# EAGLE design JeeLabs-jeenode-USB (EAGLE 5.07)
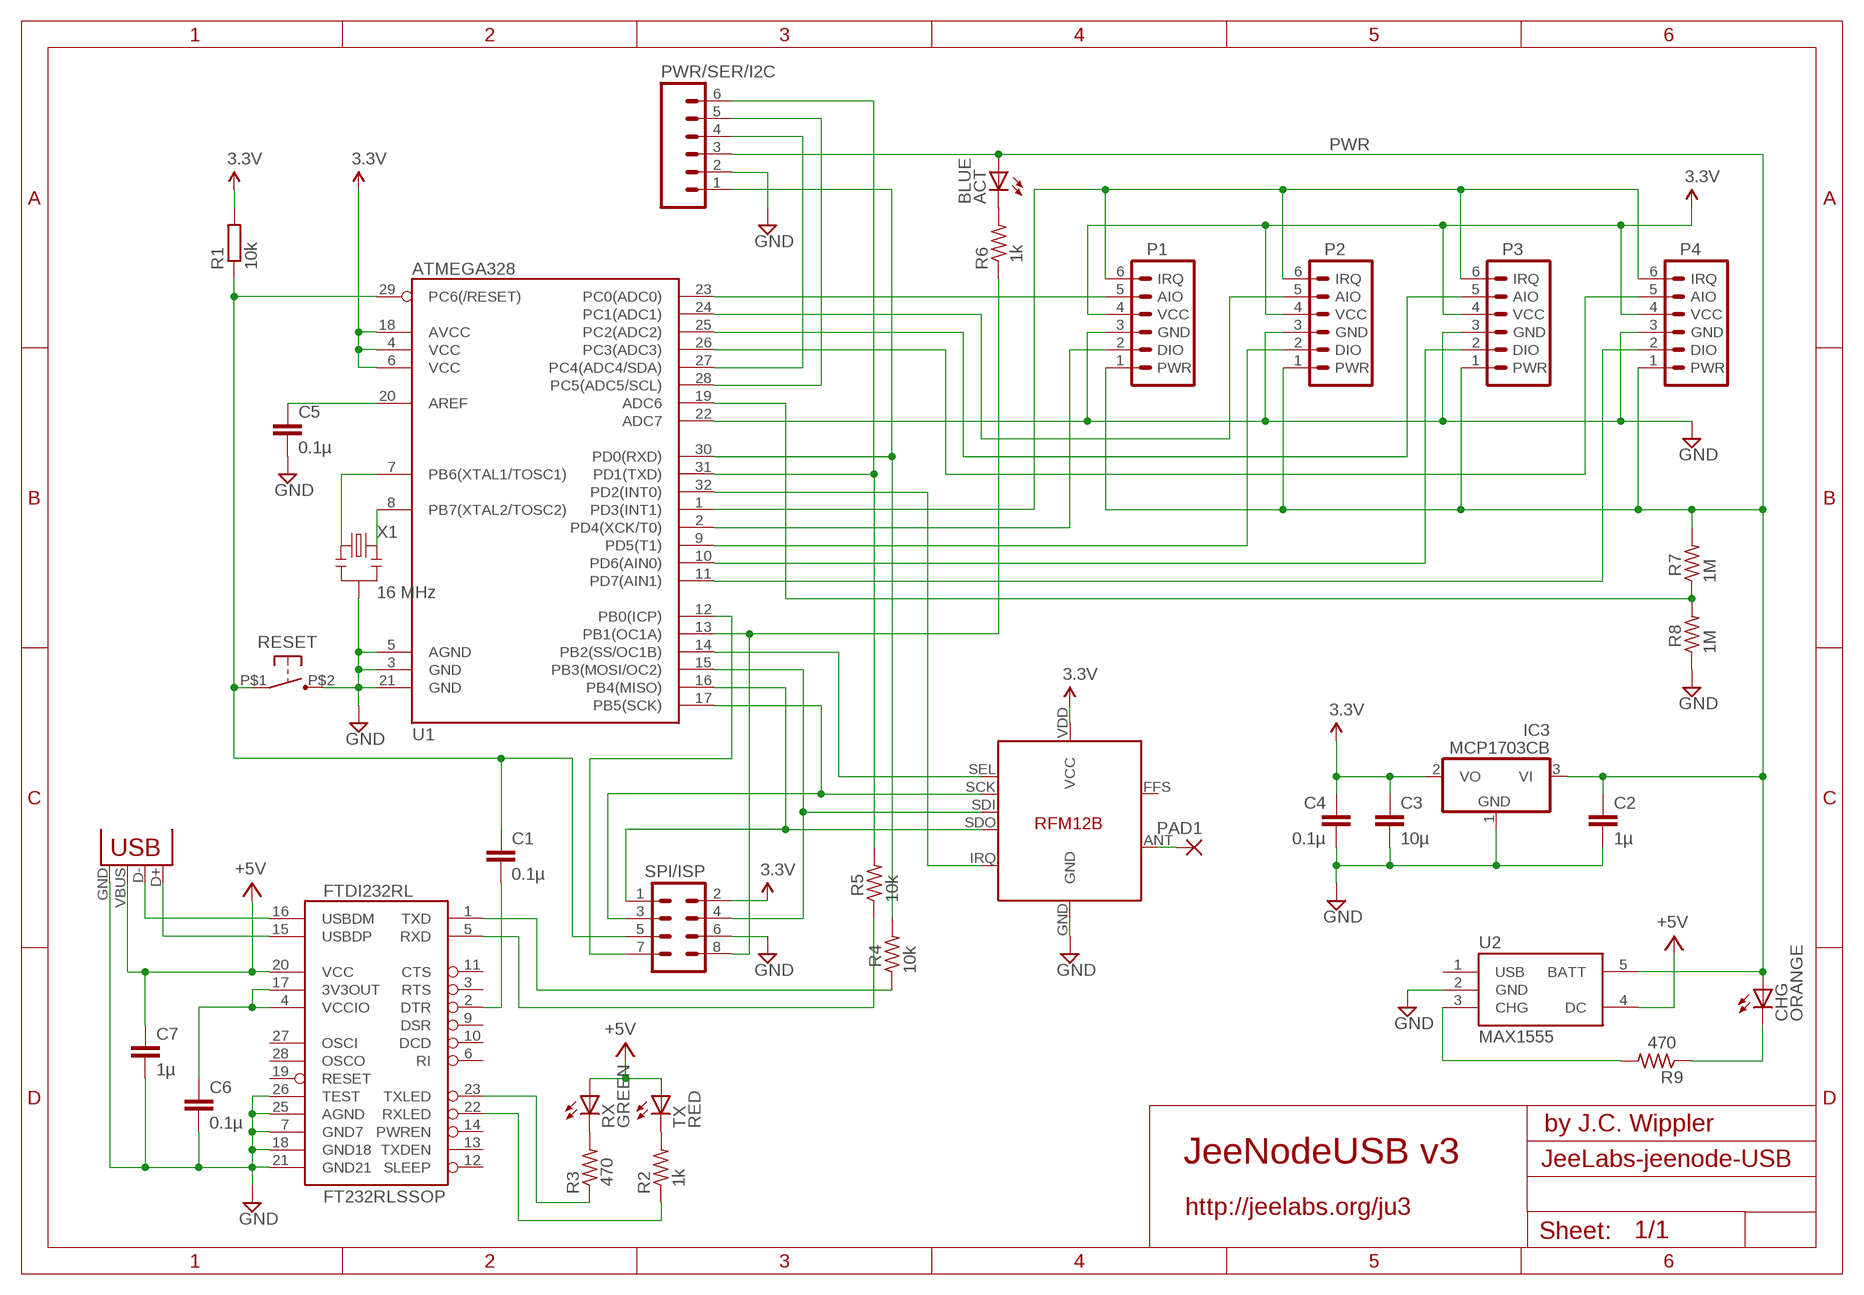
[diagram p0: schematic, sheet 1]

## Parts
ACT  BLUE  LED0603  [LED-0603]
C1  0.1µ  C-EUC0603  [C0603]
C2  1µ  C-EUC0603  [C0603]
C3  10µ  CAP0603-CAP  [0603-CAP]
C4  0.1µ  C-EUC0603  [C0603]
C5  0.1µ  C-EUC0603  [C0603]
C6  0.1µ  C-EUC0603  [C0603]
C7  1µ  C-EUC0603  [C0603]
CHG  ORANGE  LED0603  [LED-0603]
FTDI232RL  FT232RLSSOP  [SSOP28DB]
IC3  MCP1703CB  [SOT23]
P1  JEEPORT  JEEPORT-FEMALE  [1X06_FEMALE_LOCK.010]
P2  JEEPORT  JEEPORT-FEMALE  [1X06_FEMALE_LOCK.010]
P3  JEEPORT  JEEPORT-FEMALE  [1X06_FEMALE_LOCK.010]
P4  JEEPORT  JEEPORT-FEMALE  [1X06_FEMALE_LOCK.010]
PAD1  1,6/0,8  [1,6/0,8]
PWR/SER/I2C  PSI  M06SIP  [1X06]
R1  10k  R-EU_R0603  [R0603]
R2  1k  R-US_R0603  [R0603]
R3  470  R-US_R0603  [R0603]
R4  10k  R-US_R0603  [R0603]
R5  10k  R-US_R0603  [R0603]
R6  1k  R-US_R0603  [R0603]
R7  1M  R-US_R0603  [R0603]
R8  1M  R-US_R0603  [R0603]
R9  470  R-US_R0603  [R0603]
RESET  OMRON_B3U-1000_TACT_SW  [BC3-1000]
RX  GREEN  LED0603  [LED-0603]
SV7  SPI/ISP  MA04-2  [MA04-2]
TX  RED  LED0603  [LED-0603]
U1  ATMEGA328  ATMEGA168  [TQFP32-08]
U2  MAX1555  [SOT23-5]
U$1  RFM12B  [RFM12B]
USB  USBSMD  [USB-MINIB]
X1  16 MHz  RESONATORSMD  [RESONATOR-SMD]

## Nets
3.3V [power]: C3.1 C4.1 IC3.2(VO) P1.4(VCC) P2.4(VCC) P3.4(VCC) P4.4(VCC) R1.2 SV7.2 U1.4(VCC) U1.6(VCC) U1.18(AVCC) U$1.VDD(VCC)
+5V [power]: C7.1 FTDI232RL.20(VCC) RX.A TX.A U2.4(DC) USB.VBUS
A0: P1.5(AIO) U1.23(PC0(ADC0))
A1: P2.5(AIO) U1.24(PC1(ADC1))
A2: P3.5(AIO) U1.25(PC2(ADC2))
A3: P4.5(AIO) U1.26(PC3(ADC3))
GND [power]: C2.2 C3.2 C4.2 C5.2 C6.2 C7.2 FTDI232RL.7(GND7) FTDI232RL.18(GND18) FTDI232RL.21(GND21) FTDI232RL.25(AGND) FTDI232RL.26(TEST) IC3.1(GND) P1.3(GND) P2.3(GND) P3.3(GND) P4.3(GND) PWR/SER/I2C.2 R8.1 RESET.P$2 SV7.6 U1.3(GND) U1.5(AGND) U1.21(GND) U1.22(ADC7) U2.2(GND) U$1.GND USB.GND X1.2
INT1: P1.6(IRQ) P2.6(IRQ) P3.6(IRQ) P4.6(IRQ) U1.1(PD3(INT1))
N$1: U1.7(PB6(XTAL1/TOSC1)) X1.1
N$2: SV7.1 U1.16(PB4(MISO)) U$1.SDO
N$3: SV7.4 U1.15(PB3(MOSI/OC2)) U$1.SDI
N$4: U1.14(PB2(SS/OC1B)) U$1.SEL
N$5: SV7.3 U1.17(PB5(SCK)) U$1.SCK
N$6: R6.1 SV7.8 U1.13(PB1(OC1A))
N$7: U1.32(PD2(INT0)) U$1.IRQ
N$8: P1.2(DIO) U1.2(PD4(XCK/T0))
N$9: P2.2(DIO) U1.9(PD5(T1))
N$10: P3.2(DIO) U1.10(PD6(AIN0))
N$11: P4.2(DIO) U1.11(PD7(AIN1))
N$12: C5.1 U1.20(AREF)
N$13: C1.2 FTDI232RL.2(DTR)
N$14: ACT.C R6.2
N$15: FTDI232RL.16(USBDM) USB.D-
N$16: FTDI232RL.15(USBDP) USB.D+
N$17: FTDI232RL.1(TXD) R4.1
N$18: PAD1.1(P) U$1.ANT
N$19: R7.1 R8.2 U1.19(ADC6)
N$20 [power]: C6.1 FTDI232RL.4(VCCIO) FTDI232RL.17(3V3OUT)
N$21: U1.8(PB7(XTAL2/TOSC2)) X1.3
N$22: SV7.7 U1.12(PB0(ICP))
N$23: CHG.C R9.1
N$24: PWR/SER/I2C.5 U1.28(PC5(ADC5/SCL))
N$25: PWR/SER/I2C.4 U1.27(PC4(ADC4/SDA))
N$26: R9.2 U2.3(CHG)
N$29: R2.2 TX.C
N$30: R3.2 RX.C
N$32: FTDI232RL.23(TXLED) R3.1
N$33: FTDI232RL.22(RXLED) R2.1
PWR [power]: ACT.A C2.1 CHG.A IC3.3(VI) P1.1(PWR) P2.1(PWR) P3.1(PWR) P4.1(PWR) PWR/SER/I2C.3 R7.2 U2.5(BATT)
RST: C1.1 R1.1 RESET.P$1 SV7.5 U1.29(PC6(/RESET))
RXD: PWR/SER/I2C.1 R4.2 U1.30(PD0(RXD))
TXD: PWR/SER/I2C.6 R5.2 U1.31(PD1(TXD))
TXD1: FTDI232RL.5(RXD) R5.1
Unconnected: FTDI232RL.3(RTS) FTDI232RL.6(RI) FTDI232RL.9(DSR) FTDI232RL.10(DCD) FTDI232RL.11(CTS) FTDI232RL.12(SLEEP) FTDI232RL.13(TXDEN) FTDI232RL.14(PWREN) FTDI232RL.19(RESET) FTDI232RL.27(OSCI) FTDI232RL.28(OSCO) U2.1(USB) U$1.FFS

## Notes on the sheet
- by J.C. Wippler
- JeeNodeUSB v3
- http://jeelabs.org/ju3

## Library data of the parts
ACT CHG RX TX = SparkFun:LED: LEDs Standard schematic elements and footprints for 5mm, 3mm, 1206, and 0603 sized LEDs. 5mm - Spark Fun Electronics SKU : COM-00529 (and others)
C1 C2 C4-C7 = resistor:C-EU: CAPACITOR, European symbol
C3 = SparkFun:CAP: Capacitor Standard 0603 ceramic capacitor, and 0.1" leaded capacitor.
FTDI232RL = SparkFun:FT232RL: USB UART FT232RL 4th Generation USB UART (USB <-> Serial) Controller. Spark Fun Electronics SKU : COM-00650
IC3 = linear:MCP1703: 250 mA, 16V, Low Quiescent Current LDO Regulator Source: http://ww1.microchip.com/downloads/en/DeviceDoc/22049b.pdf
P1-P4 = JeeLabs:JEEPORT: PIN HEADER
PAD1 = wirepad:1,6/0,8: THROUGH-HOLE PAD
PWR/SER/I2C = SparkFun:M06: Header 6 Standard 6-pin 0.1" header. Use with straight break away headers (SKU : PRT-00116), right angle break away headers (PRT-00553), swiss pins (PRT-00743), machine pins (PRT-00117), and female headers (PRT-00115). Molex polarized connector foot print use with SKU : PRT-08094 with associated crimp pins and housings. NOTES ON THE VARIANTS LOCK and LOCK_LONGPADS... This footprint was designed to help hold the alignment of a through-hole component (i.e. 6-pin header) while soldering it into place. You may notice that each hole has been shifted either up or down by 0.005 of an inch from it's more standard position (which is a perfectly straight line). This slight alteration caused the pins (the squares in the middle) to touch the edges of the holes. Because they are alternating, it causes a "brace" to hold the component in place. 0.005 has proven to be the perfect amount of "off-center" position when using our standard breakaway headers. Although looks a little odd when you look at the bare footprint, once you have a header in there, the alteration is very hard to notice. Also, if you push a header all the way into place, it is covered up entirely on the bottom side. This idea of altering the position of holes to aid alignment will be further integrated into the Sparkfun Library for other footprints. It can help hold any component with 3 or more connection pins.
R1 = resistor:R-EU_: RESISTOR, European symbol
R2-R9 = rcl:R-US_: RESISTOR, American symbol
RESET = ModernDevice:OMRON_B3U-1000_TACT_SW
SV7 = JeeLabs:MA04-2: PIN HEADER
U1 = SparkFun:ATMEGA168
U2 = SparkFun:MAX1555: MAX1555 Lithium Charger IC SOT-23 Lithium Polymer charging IC. Schematic element and footprint proven. Spark Fun Electronics SKU : COM-00674
U$1 = JeeLabs:RFM12B
USB = SparkFun:USB: USB Connectors USB-B-PTH is fully proven SKU : PRT-00139 USB-miniB is fully proven SKU : PRT-00587 USB-A-PCB is untested. USB-A-H is throughly reviewed, but untested. Spark Fun Electronics SKU : PRT-00437 USB-B-SMT is throughly reviewed, but untested. Needs silkscreen touching up. USB-A-S has not been used/tested USB-MB-H has not been used/tested
X1 = SparkFun:RESONATOR: Resonator Small SMD resonator. This is the itty bitty 10/20MHz resonators with built in caps. CSTCE10M0G55 and CSTCE20M0V53. Footprint has been reviewed closely but hasn't been tested yet.

## Net classes
0 default: width 0.2 mm
1 power: width 0.305 mm

## Board
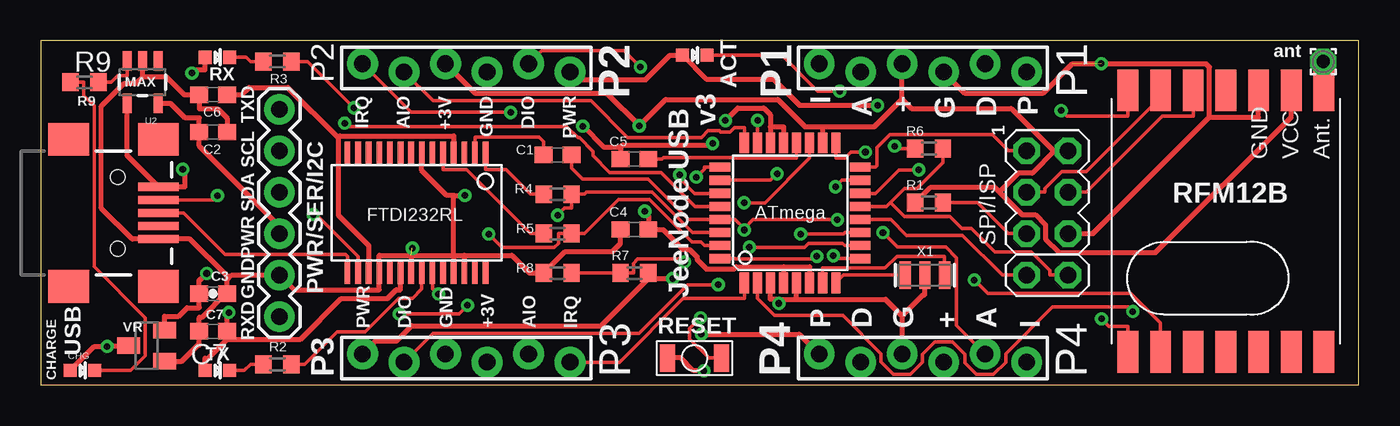
[diagram p1: board, top side]
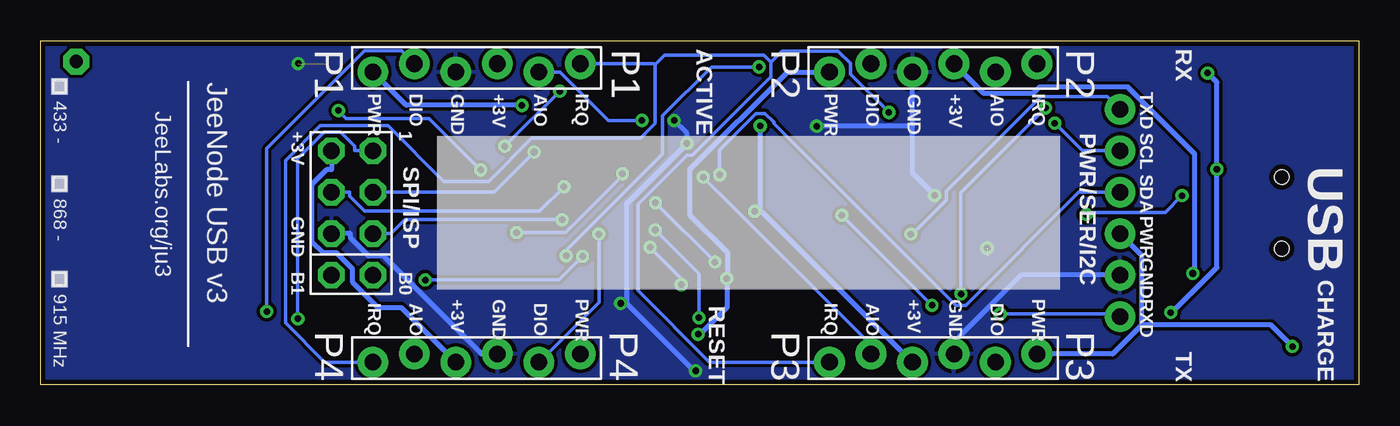
[diagram p2: board, bottom side, seen from below]

Size 80.64 x 21.08 mm. Coordinates in mm from the lower left corner, seen from the top.
Outline: 0,0 80.64,0 80.64,21.08 0,21.08 0,0
Copper layers (1*16): Top 0.035mm / dielectric 1.5mm / Bottom 0.035mm
Design rules "10mils *": minimum track width 0.2mm, minimum drill 0.4mm, track to track 8mil, track to pad 8mil, pad to pad 8mil, via to via 8mil, smd to smd 8mil, copper to edge 12mil, drill to drill 0.4mm, minimum pad ring 0.3mm, minimum via ring 8mil, stop-mask expansion 4mil, vias tented up to drill 20mil, thermal gap 10mil
tRestrict: area 0,0 to 80.6,0.3

### Footprints (pad centres in the part's own frame; a part is rotated, then mirrored left to right if it is on the bottom)
LED-0603 = smd 0.8 x 0.8: A 0,-0.75; C 0,0.75
C0603 = smd 1.1 x 1: 1 -0.85,0; 2 0.85,0
0603-CAP = smd 1.1 x 1: 1 -0.85,0; 2 0.85,0
SSOP28DB = smd 0.348 x 1.397: 1 -4.225,-3.656; 2 -3.575,-3.656; 3 -2.925,-3.656; 4 -2.275,-3.656; 5 -1.625,-3.656; 6 -0.975,-3.656; 7 -0.325,-3.656; 8 0.325,-3.656; 9 0.975,-3.656; 10 1.625,-3.656; 11 2.275,-3.656; 12 2.925,-3.656; 13 3.575,-3.656; 14 4.225,-3.656; 15 4.225,3.656; 16 3.575,3.656; 17 2.925,3.656; 18 2.275,3.656; 19 1.625,3.656; 20 0.975,3.656; 21 0.325,3.656; 22 -0.325,3.656; 23 -0.975,3.656; 24 -1.625,3.656; 25 -2.275,3.656; 26 -2.925,3.656; 27 -3.575,3.656; 28 -4.225,3.656
SOT23 = smd 1 x 1.4: 1 -0.95,-1.1; 2 0.95,-1.1; 3 0,1.1
1X06_FEMALE_LOCK.010 = drill 1.016 pad 1.88 round: 1 0,0.254; 2 2.54,-0.254; 3 5.08,0.254; 4 7.62,-0.254; 5 10.16,0.254; 6 12.7,-0.254
1,6/0,8 = drill 0.813 pad 1.6 octagon: 1 0,0
1X06 = drill 1.016 pad 1.88 round: 1 0,0; 2 2.54,0; 3 5.08,0; 4 7.62,0; 5 10.16,0; 6 12.7,0
R0603 = smd 1 x 1.1: 1 -0.85,0; 2 0.85,0
BC3-1000 = smd 0.9 x 1.7: P$1 1.65,0; P$2 -1.65,0
MA04-2 = drill 1.016 octagon: 1 -3.81,-1.27; 2 -3.81,1.27; 3 -1.27,-1.27; 4 -1.27,1.27; 5 1.27,-1.27; 6 1.27,1.27; 7 3.81,-1.27; 8 3.81,1.27
TQFP32-08 = smd 1.27 x 0.559: 1 -4.293,2.8; 2 -4.293,2; 3 -4.293,1.2; 4 -4.293,0.4; 5 -4.293,-0.4; 6 -4.293,-1.2; 7 -4.293,-2; 8 -4.293,-2.8; 17 4.293,-2.8; 18 4.293,-2; 19 4.293,-1.2; 20 4.293,-0.4; 21 4.293,0.4; 22 4.293,1.2; 23 4.293,2; 24 4.293,2.8 | smd 0.559 x 1.27: 9 -2.8,-4.293; 10 -2,-4.293; 11 -1.2,-4.293; 12 -0.4,-4.293; 13 0.4,-4.293; 14 1.2,-4.293; 15 2,-4.293; 16 2.8,-4.293; 25 2.8,4.293; 26 2,4.293; 27 1.2,4.293; 28 0.4,4.293; 29 -0.4,4.293; 30 -1.2,4.293; 31 -2,4.293; 32 -2.8,4.293
SOT23-5 = smd 0.55 x 1.2: 1 -0.95,-1.3; 2 0,-1.3; 3 0.95,-1.3; 4 0.95,1.3; 5 -0.95,1.3
RFM12B = smd 2.54 x 1.27: ANT 8,-6; FFS -8,2; GND 8,-2; IRQ -8,4; P$8 -8,0; P$9 -8,-2; P$10 -8,-4; P$12 -8,-6; P$16 8,0; SCK 8,4; SDI 8,2; SDO -8,6; SEL 8,6; VDD 8,-4
USB-MINIB = smd 2.5 x 0.5: D+ 2.5,0; D- 2.5,0.8; GND 2.5,-1.6; ID 2.5,-0.8; VBUS 2.5,1.6 | smd 2.5 x 2: GND@1 -3,-4.5; GND@2 -3,4.5; GND@3 2.5,4.5; GND@4 2.5,-4.5 | hole 0.9: 0,2.2; 0,-2.2
RESONATOR-SMD = smd 0.7 x 1.7: 1 -1.2,0; 2 0,0; 3 1.2,0

### Placement (x,y rotation side)
ACT  40.01,20.19 270 top
C1  31.62,14.1 180 top
C2  10.54,15.49 0 top
C3  10.54,5.59 0 top
C4  36.32,9.53 180 top
C5  36.32,13.84 180 top
C6  10.54,17.78 180 top
C7  10.54,3.3 180 top
CHG  2.54,0.89 270 top
FTDI232RL  22.99,10.54 180 top
IC3  6.48,2.41 90 top
P1  60.33,19.43 180 top
P2  32.39,19.43 180 top
P3  19.68,1.65 0 top
P4  47.62,1.65 0 top
PAD1  78.49,19.81 0 top
PWR/SER/I2C  14.61,4.19 90 top
R1  54.36,11.18 180 top
R2  14.48,1.27 180 top
R3  14.48,19.81 180 top
R4  31.62,11.68 0 top
R5  31.62,9.27 0 top
R6  54.36,14.48 180 top
R7  36.32,6.86 0 top
R8  31.62,6.86 0 top
R9  2.67,18.54 0 top
RESET  40.01,1.65 0 top
RX  10.79,20.07 270 top
SV7  61.59,10.54 270 top
TX  10.79,0.89 270 top
U1  45.85,10.54 90 top
U2  6.22,18.54 180 top
U$1  72.52,10.03 90 top
USB  4.7,10.54 0 top
X1  54.1,6.73 180 top

### Tracks (layer width: path | path; a pad name or v marks a point on that pad's centre or on a via)
3.3V  (via drill 0.4 pad 0.81)
  Top 0.305: 52.71,17.53 P1.4 | 47.85,15.82 51,15.82 52.71,17.53 | 62.01,14.31 59.38,16.94 53.29,16.94 52.71,17.53 | 62.01,14.31 62.05,14.35 62.31,14.35 SV7.2 | 58.66,11.83 59.81,12.98 60.67,12.98 62.01,14.31 | 47.85,15.82 46.76,15.82 45.1,17.48 38.23,17.48 v36.62,15.88 34.63,17.87 26.58,17.87 P2.4 | 47.85,15.82 U1.18 | R1.2 54.41,12.08 58.4,12.08 58.66,11.83 | 58.66,11.83 60.05,10.44 60.86,10.44 61.49,9.8 61.49,8.94 62.32,8.11 68.22,8.11 76.52,16.41 U$1.VDD | 45.45,7.24 42.55,7.24 42.41,7.11 40.73,7.11 40.15,7.68 40.15,7.85 39.71,8.29 39.31,8.29 38.08,9.53 C4.1 37.17,9.95 37.17,10.38 36.95,10.6 v36.95,10.64 | U1.6 47.05,7.24 45.45,7.24 | 45.45,7.24 U1.4 | v10.15,6.83 9.76,6.44 9.69,6.44 C3.1 9.69,4.73 8.95,4.73 8.43,4.22 7.58,4.22 IC3.2 | v36.95,10.64
  Bottom 0.305: 36.62,10.64 36.55,10.64 P3.4 | 36.62,10.64 v36.95,10.64 | v36.62,15.88 36.62,10.64 | P2.4 22.93,17.85 19.92,17.85 19.53,18.25 14.12,18.25 10.03,14.16 10.03,6.96 v10.15,6.83 | P4.4 58.6,4.75 60.02,4.75 61.59,6.32 61.59,7.14 62.56,8.11 63.37,8.11 64.07,8.81 64.07,12.28 63.16,13.19 62.87,13.19 SV7.2
+5V  (via drill 0.4 pad 0.81)
  Top 0.305: v11.5,4.44 11.5,4.26 11.39,4.16 C7.1 11.39,2.8 | 11.39,2.8 10.24,1.64 10.04,1.64 TX.A | 11.39,2.8 15.89,2.8 18.39,5.3 21.22,5.3 21.75,5.83 22.01,5.83 FTDI232RL.20 | v8.68,13.22 8.8,13.09 8.8,12.14 USB.VBUS 5.27,14.07 U2.4 | RX.A 10.04,19.31 9.45,19.31 v9.25,19.11
  Bottom 0.305: v11.5,4.44 11.43,4.44 8.68,7.2 v8.68,13.22 8.68,18.54 v9.25,19.11
A0  (via drill 0.4 pad 0.81)
  Top 0.2: U1.23 43.85,15.77 43.86,15.79 v43.86,16.21
  Bottom 0.2: v43.86,16.21 45.9,16.21 48.88,19.18 P1.5
A1
  Top 0.2: P2.5 23.99,17.41 33.66,17.41 35.9,15.17 40.42,15.17 40.82,15.57 41.52,15.57 41.6,15.49 42.18,15.49 42.46,15.77 43.05,15.77 U1.24
A2  (via drill 0.4 pad 0.81)
  Top 0.2: v40.11,12.73 40.62,13.23 40.62,13.34 U1.25
  Bottom 0.2: P3.5 29.84,2.46 v40.11,12.73
A3  (via drill 0.4 pad 0.81)
  Top 0.2: U1.26 44.66,12.54 v45.05,12.94 | v51.53,9.34 52.42,8.45 55.38,8.45 56.04,7.78 56.04,3.65 P4.5
  Bottom 0.2: v45.05,12.94 45.05,12.82 48.54,9.34 v51.53,9.34
GND  (via drill 0.4 pad 0.81)  (2 unrouted)
  Top 0.305: v33.17,15.85 34.43,14.59 35.47,14.59 | v41.89,16.2 42.66,16.96 44.24,16.96 44.65,16.56 44.65,15.82 | 25.91,7.94 28.84,7.94 29.92,6.86 R8.1 32.08,8.17 34.97,8.17 35.47,8.67 C4.2 | 25.26,7.94 25.91,7.94 | 25.26,11.61 24.84,11.61 23.31,13.14 FTDI232RL.7 | 25.26,11.61 v25.94,11.61 | 25.26,7.94 25.26,11.61 | 35.47,14.59 35.6,14.71 41.02,14.71 v41.11,14.8 | 44.65,15.82 U1.22 | 44.65,15.82 45.45,15.82 U1.21 | 35.47,14.59 C5.2 | 45.16,5.26 46.25,5.26 | 45.16,5.26 44.65,5.26 U1.3 | v45.16,5 45.16,5.26 | v40.58,0.87 39.94,0.87 39.16,1.65 RESET.P$2 | 22.66,7.94 20.71,7.94 FTDI232RL.18 20.71,6.36 20.71,5.83 15.51,5.83 PWR/SER/I2C.2 11.68,6.73 11.39,6.44 | 22.66,7.94 25.26,7.94 | 22.66,7.94 FTDI232RL.21 | 11.39,6.44 11.39,6.67 9.12,8.94 USB.GND 5.59,8.94 3.71,10.83 3.71,17.08 5.11,18.48 5.82,18.48 6.22,18.89 | 52.71,4.24 51.69,5.26 46.25,5.26 | 52.71,4.24 P4.3 | 52.71,4.24 53.99,5.52 54.1,5.52 X1.2 | 46.25,5.26 U1.5 | 25.91,7.94 25.91,7.68 25.91,7.41 FTDI232RL.26 | 25.26,7.94 FTDI232RL.25 | 11.39,5.69 9.86,4.16 9.69,4.16 C7.2 9.69,2.87 9.69,2.45 9.62,2.45 8.63,1.46 IC3.1 | 11.39,5.69 11.39,6.44 | 11.39,5.69 C3.2 | 6.22,18.89 7.68,18.89 8.79,17.78 C6.2 9.69,16.92 10.82,16.92 11.39,16.35 C2.2 | 6.22,18.89 U2.2 | 71.52,16.41 71.52,19.48 71.34,19.66 63.11,19.66 61.31,17.86 56.56,17.86 P1.3 | SV7.6 64.38,9.27 71.52,16.41 | 71.52,16.41 74.52,16.41 U$1.GND
  Bottom 0.305: v41.89,16.2 41.11,15.42 v41.11,14.8 44.81,11.1 44.81,5 | 27.3,15.85 27.3,12.98 v25.94,11.61 | 27.3,15.85 P2.3 | 27.3,15.85 v33.17,15.85 | 44.81,5 v45.16,5 | v40.58,0.87 40.68,0.87 44.81,5 | PWR/SER/I2C.2 20.67,6.73 24.76,2.64 P3.3 | SV7.6 61.7,9.27 61.7,9 60.6,7.9 59.67,7.9 53.68,1.91 P4.3
  other vias: 64.9,19.69 22.73,8.38
  pour Bottom: 0,21.08 80.64,21.08 80.64,0 0,0
INT1  (via drill 0.4 pad 0.81)
  Top 0.2: P3.6 35.4,1.4 39.31,5.31 43.05,5.31 U1.1 | P2.6 22.66,16.71 v28.75,16.71
  Bottom 0.2: 43.06,19.61 43.06,16 43.94,15.12 50.61,15.12 53.26,12.47 56,12.47 59.41,15.89 63.55,15.89 65.67,13.76 65.67,3.8 63.27,1.4 P4.6 | P1.6 43.14,19.69 43.06,19.61 | 43.06,19.61 42.47,20.2 36.4,20.2 35.97,19.78 | P3.6 39.71,1.4 44.11,5.8 44.11,11.08 41.1,14.09 40.76,14.09 35.97,18.88 35.97,19.78 | v28.75,16.71 31.1,19.05 31.1,19.71 31.85,20.45 35.3,20.45 35.97,19.78
N$1
  Top 0.2: U1.7 47.85,7.19 49.23,7.19 49.26,7.16 51.66,7.16 52.39,7.88 55.3,7.88 X1.1
N$2  (via drill 0.4 pad 0.81)
  Top 0.2: SV7.1 59.21,14.35 58.23,15.33 51.96,15.33 51.17,14.54 51.17,13.43 51.08,13.34 U1.16 | v64.91,4.06 65.37,3.61 66.52,3.61 U$1.SDO
  Bottom 0.2: v64.91,4.06 64.91,13.88 63.31,15.48 62.29,15.48 61.44,14.63 61.44,14.35 SV7.1
N$3  (via drill 0.4 pad 0.81)
  Top 0.2: U1.15 49.03,12.54 v48.63,12.14 | SV7.4 63.98,11.81 68.62,16.46 70.52,16.46 U$1.SDI
  Bottom 0.2: v48.63,12.14 50.12,10.65 60.82,10.65 61.75,11.58 61.75,11.81 SV7.4
N$4  (via drill 0.4 pad 0.81)
  Top 0.2: v53.73,13.18 52.52,13.18 51.08,11.74 U1.14 | U$1.SEL 66.52,16.46 62.79,16.46 v62.44,16.81
  Bottom 0.2: v53.73,13.18 56.88,16.33 61.95,16.33 v62.44,16.81
N$5  (via drill 0.4 pad 0.81)
  Top 0.2: U1.17 48.65,13.9 49.21,13.9 49.58,14.27 v50.46,14.27 | U$1.SCK 68.52,17.61 63.98,13.08 62.48,13.08 61.44,12.04 61.44,11.81 SV7.3
  Bottom 0.2: v50.46,14.27 52.92,11.81 SV7.3
N$6
  Top 0.2: 51.99,11.18 52.86,10.32 55.62,10.32 56.37,9.58 56.94,9.58 58.37,8.14 60.62,8.14 61.75,7.01 61.75,6.73 SV7.8 | 51.99,11.18 52.84,12.03 53.61,12.03 55.21,13.62 R6.1 | U1.13 51.75,10.94 51.99,11.18
N$7  (via drill 0.4 pad 0.81)
  Top 0.2: U1.32 42.49,7.74 42.5,7.73 47.34,7.73 v47.49,7.88 | v57.12,6.43 57.95,5.61 66.72,5.61 68.52,3.81 68.52,3.61 U$1.IRQ
  Bottom 0.2: v57.12,6.43 | v57.12,6.43 48.94,6.43 v47.49,7.88
N$8  (via drill 0.4 pad 0.81)
  Top 0.2: U1.2 43.85,5.31 44.9,4.26 49.08,4.26 51.41,1.92 51.41,1.42 52.17,0.66 53.22,0.66 53.95,1.39 53.95,1.89 54.7,2.64 55.79,2.64 56.54,1.89 56.54,1.37 57.26,0.66 58.3,0.66 59.04,1.4 59.04,1.9 61.91,4.77 66.55,4.77 v66.82,4.5
  Bottom 0.2: v66.82,4.5 66.82,14.48 60.83,20.47 58.57,20.47 P1.2
N$9  (via drill 0.4 pad 0.81)
  Top 0.2: U1.9 48.68,7.74 v48.5,7.92 | v36.7,19.48 35.7,20.47 30.63,20.47 P2.2
  Bottom 0.2: v48.5,7.92 | v48.5,7.92 48.5,8.25 42.6,14.15 42.6,16.49 39.61,19.48 v36.7,19.48
N$10  (via drill 0.4 pad 0.81)
  Top 0.2: U1.10 49.2,8.54 49.07,8.67 46.97,8.67 46.73,8.44 v43.36,8.44 | v41.46,6.14 39.57,6.14 36.6,3.17 24,3.17 P3.2
  Bottom 0.2: v43.36,8.44 41.46,6.54 v41.46,6.14
N$11  (via drill 0.4 pad 0.81)
  Top 0.2: U1.11 49.2,9.34 49.11,9.25 v46.5,9.25
  Bottom 0.2: v46.5,9.25 46.5,5.06 P4.2
N$12
  Top 0.2: C5.1 38.02,13.84 38.11,13.93 42.46,13.93 42.49,13.9 46.25,13.9 U1.20
N$13
  Top 0.2: C1.2 30.77,14.9 30.47,15.2 26.56,15.2 FTDI232RL.2
N$14  (via drill 0.4 pad 0.81)
  Top 0.2: ACT.C 45.34,20.19 47.54,18 v48.88,18 | R6.2 52.41,14.48 v52.26,14.63
  Bottom 0.2: v48.88,18 v52.26,14.63
N$15  (via drill 0.4 pad 0.81)
  Top 0.2: FTDI232RL.16 19.41,7.89 16.86,10.44 v16.67,10.44 | USB.D- 10.55,11.34 v10.81,11.6
  Bottom 0.2: v10.81,11.6 11.85,10.57 16.54,10.57 v16.67,10.44
N$16
  Top 0.2: USB.D+ 8.75,10.54 11.29,8 18.65,8 18.76,7.89 FTDI232RL.15
N$17
  Top 0.2: FTDI232RL.1 27.21,13.2 28.46,13.2 29.97,11.68 R4.1
N$18
  Top 0.2: U$1.ANT 78.52,19.61 78.49,19.64 PAD1.1
N$19  (via drill 0.4 pad 0.81)
  Top 0.2: U1.19 47.05,13.9 44.31,11.16 v43.03,11.16 | v39.4,7.53 39.22,7.71 36.53,7.71 36.27,7.46 36.27,6.86 R7.1 R8.2
  Bottom 0.2: v43.03,11.16 43.02,11.16 v39.4,7.53
N$20
  Top 0.305: 18.19,15.14 18.3,15.25 25.26,15.25 FTDI232RL.4 | FTDI232RL.17 20.06,8.53 18.19,10.4 18.19,15.14 | 18.19,15.14 15.11,18.23 12.74,18.23 12.3,17.78 C6.1
N$21
  Top 0.2: X1.3 49.13,6.73 U1.8
N$22
  Top 0.2: U1.12 52.02,10.14 52.98,9.17 56.4,9.17 58.84,6.73 SV7.7
N$23
  Top 0.2: R9.1 2.62,18.54 2.62,17.74 3.25,17.11 3.25,7.25 6.38,4.12 6.38,1.78 5.49,0.89 CHG.C
N$24  (via drill 0.4 pad 0.81)
  Top 0.2: v18.59,16.04 18.79,15.84 32.18,15.84 32.87,15.15 32.95,15.15 33.79,14.31 33.79,14.05 34.81,13.02 37.95,13.02 40.04,10.94 U1.28
  Bottom 0.2: v18.59,16.04 16.91,14.35 PWR/SER/I2C.5
N$25  (via drill 0.4 pad 0.81)
  Top 0.2: v39.1,12.88 39.1,12.64 40.01,11.74 40.62,11.74 U1.27
  Bottom 0.2: v39.1,12.88 39.1,14.39 36.87,16.63 36.33,16.63 35.79,16.09 35.79,16.02 24.64,4.87 24.05,4.87 17.11,11.81 PWR/SER/I2C.4
N$26
  Top 0.2: R9.2 4.32,18.54 4.72,18.94 5.27,18.94 U2.3
N$29
  Top 0.2: R2.2 12.83,1.27 12.44,0.89 TX.C
N$30
  Top 0.2: R3.2 12.83,19.81 12.57,20.07 RX.C
N$32  (via drill 0.4 pad 0.81)
  Top 0.2: R3.1 16.32,19.81 v19.16,16.97 | v24.34,5.58 24.03,5.88 23.96,5.88 FTDI232RL.23
  Bottom 0.2: v24.34,5.58 24.34,11.8 v19.16,16.97
N$33
  Top 0.2: R2.1 16.13,1.27 18.12,3.26 19.83,3.26 21.88,5.32 22.75,5.32 23.31,5.88 FTDI232RL.22
PWR  (via drill 0.4 pad 0.81)
  Top 0.305: v51.2,17.13 46.42,17.13 44.82,18.74 40.71,18.74 ACT.A 38.5,20.19 37.01,18.7 32.86,18.7 P2.1 | P4.1 46.42,3.11 v40.43,3.11 | 37.17,6.52 v38.67,6.52 | 37.17,6.52 R7.2 | P3.1 20.47,2.69 21.76,2.69 22.69,3.62 34.27,3.62 37.17,6.52 | IC3.3 4.32,2.41 4.28,2.37 v4.05,2.37 3.27,2.37 CHG.A | PWR/SER/I2C.3 14.61,9.72 9.69,14.64 C2.1 9.69,16.35 8.84,16.35 7.94,17.24 U2.5
  Bottom 0.305: P2.1 34.96,19.18 40.9,13.24 40.9,10.4 38.61,8.1 38.61,6.58 v38.67,6.52 38.67,4.75 40.31,3.11 v40.43,3.11 | P1.1 58.28,17.13 v51.2,17.13 | 13.27,3.68 13.27,7.93 PWR/SER/I2C.3 | P3.1 15.04,1.91 13.27,3.68 | 13.27,3.68 5.37,3.68 v4.05,2.37
RST  (via drill 0.4 pad 0.81)
  Top 0.2: 43.05,9.59 42.49,10.14 U1.29 40.62,10.14 39.65,10.14 37.17,12.62 33.15,12.62 32.47,13.29 C1.1 | v43.05,9.5 43.05,9.59 | v48.75,10.13 43.59,10.13 43.05,9.59 | v40.37,4.12 39.71,3.46 39.71,2.83 40.89,1.65 40.9,1.65 RESET.P$1 | R1.1 56.01,11.18 57.31,11.18 59.21,9.27 SV7.5
  Bottom 0.2: SV7.5 59.21,9.27 58.36,10.13 v48.75,10.13 | v43.05,9.5 40.37,6.82 v40.37,4.12
RXD  (via drill 0.4 pad 0.81)
  Top 0.2: v31.62,10.4 32.06,10.83 32.47,10.83 R4.2 33.28,11.68 33.41,11.81 37.4,11.81 39.88,9.34 40.62,9.34 U1.30 | v26.11,4.88 25.58,4.36 v21.93,4.36
  Bottom 0.2: PWR/SER/I2C.1 14.77,4.36 v21.93,4.36 | v26.11,4.88 v31.62,10.4
TXD  (via drill 0.4 pad 0.81)
  Top 0.2: U1.31 40.62,8.54 40.41,8.75 39.86,8.75 37.26,11.36 35.36,11.36 33.28,9.27 R5.2 31.67,9.27 31.67,8.67 31.42,8.42 28.23,8.42 v27.41,9.24
  Bottom 0.2: PWR/SER/I2C.6 15.39,17.68 19.45,17.68 25.24,11.9 25.24,11.32 27.31,9.24 v27.41,9.24
TXD1
  Top 0.2: FTDI232RL.5 24.61,13.2 26.04,13.2 29.97,9.27 R5.1

### Text on the board
_tsilk: P2 | P1 | ant | MAX | RX | TXD | IRQ | AIO | +3V | GND | DIO | PWR | ACT | I | A | + | G | D | P | R9 | v3 | SCL | 1 | SDA | RFM12B | PWR | ATmega | GND | PWR/SER/I2C | RXD | JeeNode USB | C7 | VR | PWR | DIO | GND | +3V | AIO | IRQ | RESET | P | D | G | + | A | I | USB | TX | CHARGE | P3 | P4
_bsilk: RX | P2 | P2 | ACTIVE | P1 | P1 | TXD | IRQ | AIO | +3V | GND | DIO | PWR | IRQ | AIO | +3V | GND | DIO | PWR | JeeNode USB v3 | JeeLabs.org/ju3 | 433 - | SCL | PWR/SER/I2C | 1 | +3V | USB | SDA | SPI/ISP | 868 - | PWR | GND | GND | B0 | B1 | CHARGE | RXD | PWR | DIO | GND | +3V | AIO | IRQ | RESET | PWR | DIO | GND | +3V | AIO | IRQ | 915 MHz | P3 | P3 | P4 | P4 | TX